# Altium schematic sheet HMIInterface.SchDoc
size A3
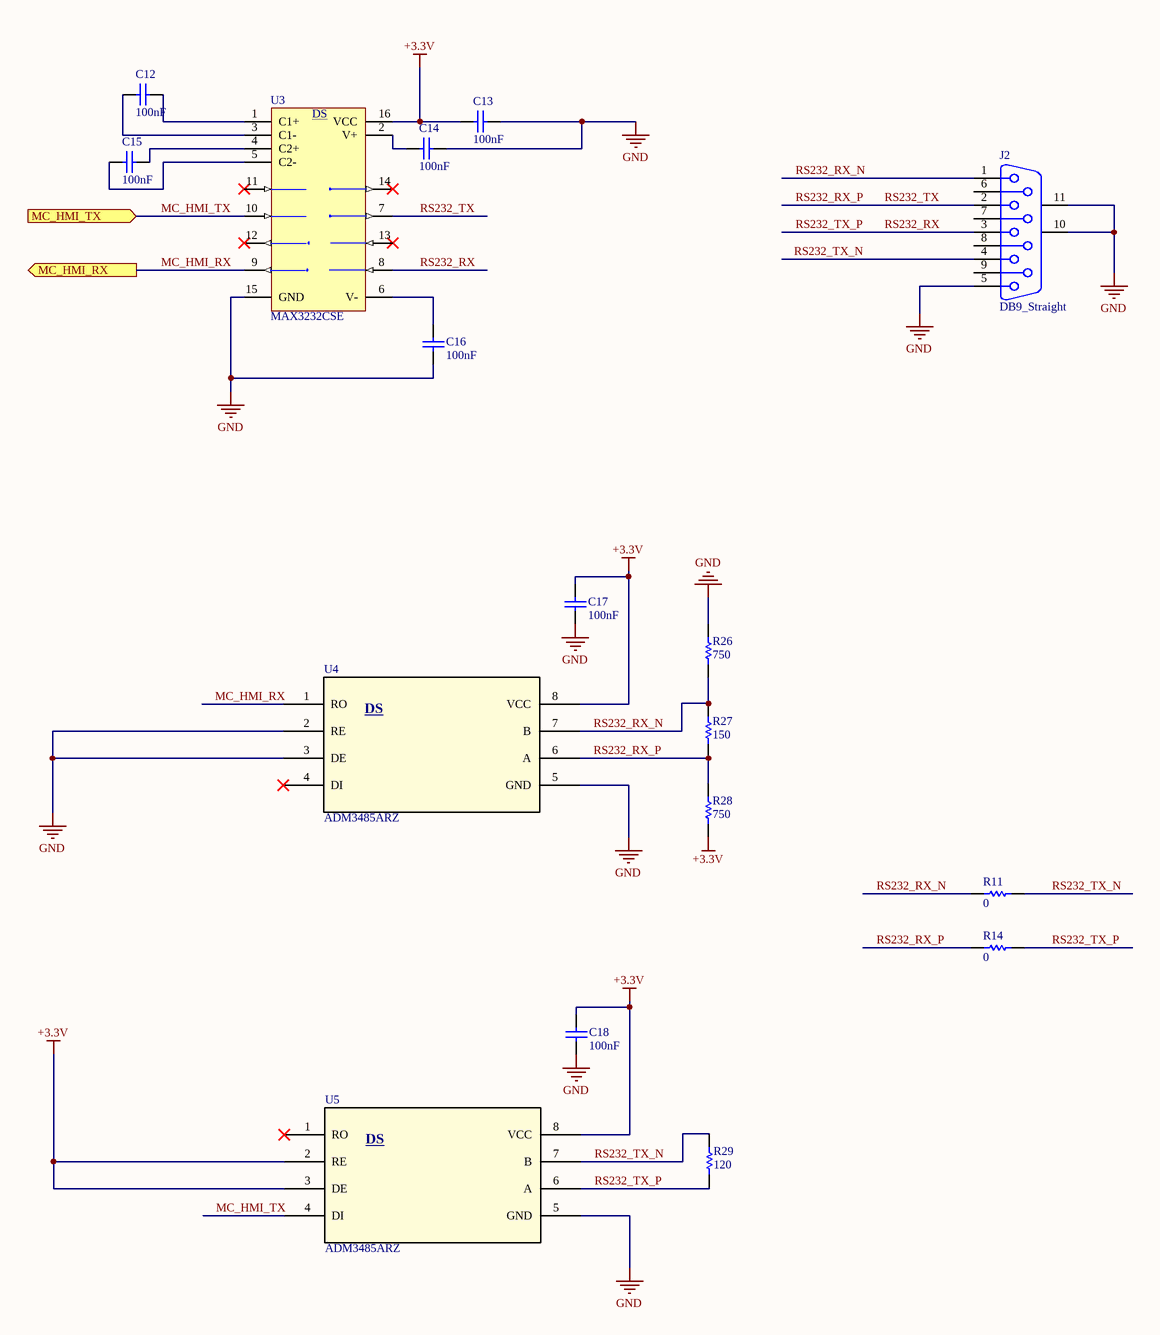
[diagram p0: HMIInterface.SchDoc]

## Parts
C12  value 100nF  [C-805]  (hidden comment: C-805)
C13  value 100nF  [C-805]  (hidden comment: C-805)
C14  value 100nF  [C-805]  (hidden comment: C-805)
C15  value 100nF  [C-805]  (hidden comment: C-805)
C16  value 100nF  [C-805]  (hidden comment: C-805)
C17  value 100nF  [C-805]  (hidden comment: C-805)
C18  value 100nF  [C-805]  (hidden comment: C-805)
J2  DB9_Straight  [DB9_Straight]
R11  value 0  [R-805]  (hidden comment: R-805)
R14  value 0  [R-805]  (hidden comment: R-805)
R26  value 750  [R-805]  (hidden comment: R-805)
R27  value 150  [R-805]  (hidden comment: R-805)
R28  value 750  [R-805]  (hidden comment: R-805)
R29  value 120  [R-805]  (hidden comment: R-805)
U3  MAX3232CSE  [MAX3232CSE]
U4  ADM3485ARZ  [R_8]
U5  ADM3485ARZ  [R_8]

## Ports
MC_HMI_RX (out), MC_HMI_TX (in)

## Nets
+3.3V: C13.2 C17.2 C18.2 R28.1 U3.16(VCC) U4.8(VCC) U5.2(RE) U5.3(DE) U5.8(VCC)
GND: C13.1 C14.1 C16.1 C17.1 C18.1 J2.5 J2.10(MH1) J2.11(MH2) R26.2 U3.15(GND) U4.2(RE) U4.3(DE) U4.5(GND) U5.5(GND)
MC_HMI_RX: U3.9(R2OUT) U4.1(RO) ; port MC_HMI_RX
MC_HMI_TX: U3.10(T2IN) U5.4(DI) ; port MC_HMI_TX
RS232_RX: J2.3 R14.1 R29.1 U3.8(R2IN) U5.6(A)  [also labelled RS232_TX_P]
RS232_RX_N: J2.1 R11.2 R26.1 R27.2 U4.7(B)
RS232_RX_P: J2.2 R14.2 R27.1 R28.2 U3.7(T2OUT) U4.6(A)  [also labelled RS232_TX]
RS232_TX_N: J2.4 R11.1 R29.2 U5.7(B)
NetC12_1: C12.1 U3.1(C1+)
NetC12_2: C12.2 U3.3(C1-)
NetC14_2: C14.2 U3.2(V+)
NetC15_1: C15.1 U3.4(C2+)
NetC15_2: C15.2 U3.5(C2-)
NetC16_2: C16.2 U3.6(V-)

Not connected (* = marked no-connect by the designer): J2 6 7 8 9; U3 11(T1IN)* 12(R1OUT)* 13(R1IN)* 14(T1OUT)*; U4 4(DI)*; U5 1(RO)*

## Notes on the sheet
- (in symbol ADM3485ARZ) DS
- (in symbol MAX3232CSE) DS

## Library data of the parts
C12-C18 = C-805: Capacitor; Published: 8-Jun-2000; LatestRevisionDate: 29-May-2009; LatestRevisionNote: IPC-7351 Footprint Added.; PackageReference: C1206; Publisher: Altium Limited; PackageDescription: Chip Capacitor
J2 = DB9_Straight: Receptacle Assembly, 9 Position, Right Angle; PackageDocument: O; Positions: 9; Published: 15-Jun-2001; LatestRevisionDate: 17-Jul-2002; LatestRevisionNote: Re-released for DXP Platform.; DatasheetDocument: 1-Sep-1999; PackageReference: 788750; Publisher: Altium Limited; Orientation: Right Angle; Gender: Receptacle
R11 R14 R26-R29 = R-805: Resistor
U3 = MAX3232CSE: 3.0V TO 5.5V, Low-Power, up to 1Mbps, True RS-232 Transceiver Using Four 0.1µF External Capacitor; Published: 16-Jan-2001; LatestRevisionDate: 13-Apr-2006; LatestRevisionNote: IPC-7351 Footprint Added.; DatasheetVersion: Mar-1999; PackageReference: NSO16; Publisher: Altium Limited; PackageDescription: 16-Pin Small Outline Integrated Circuit 1.27 mm Pitch; Code_JEDEC: MS-012-AC; Code_IPC: SOIC127P600-16; ComponentLink1Description: Manufacturer Link; ComponentLink1URL: http://www.maxim-ic.com/; ComponentLink2Description: Datasheet; ComponentLink2URL: http://pdfserv.maxim-ic.com/en/ds/MAX3222-MAX3241.pdf
U4 U5 = ADM3485ARZ: No Description Available; Vendor: Analog Devices Inc; Built_By: EMA_UL_Team; Manufacturer_Part_Number: ADM3485ARZ; Copyright: Copyright (C) 2018 Accelerated Designs. All rights reserved; RefDes: RefDes; Type: DEV; Value: Value